# Altium schematic sheet MainLogic.SchDoc
size A4
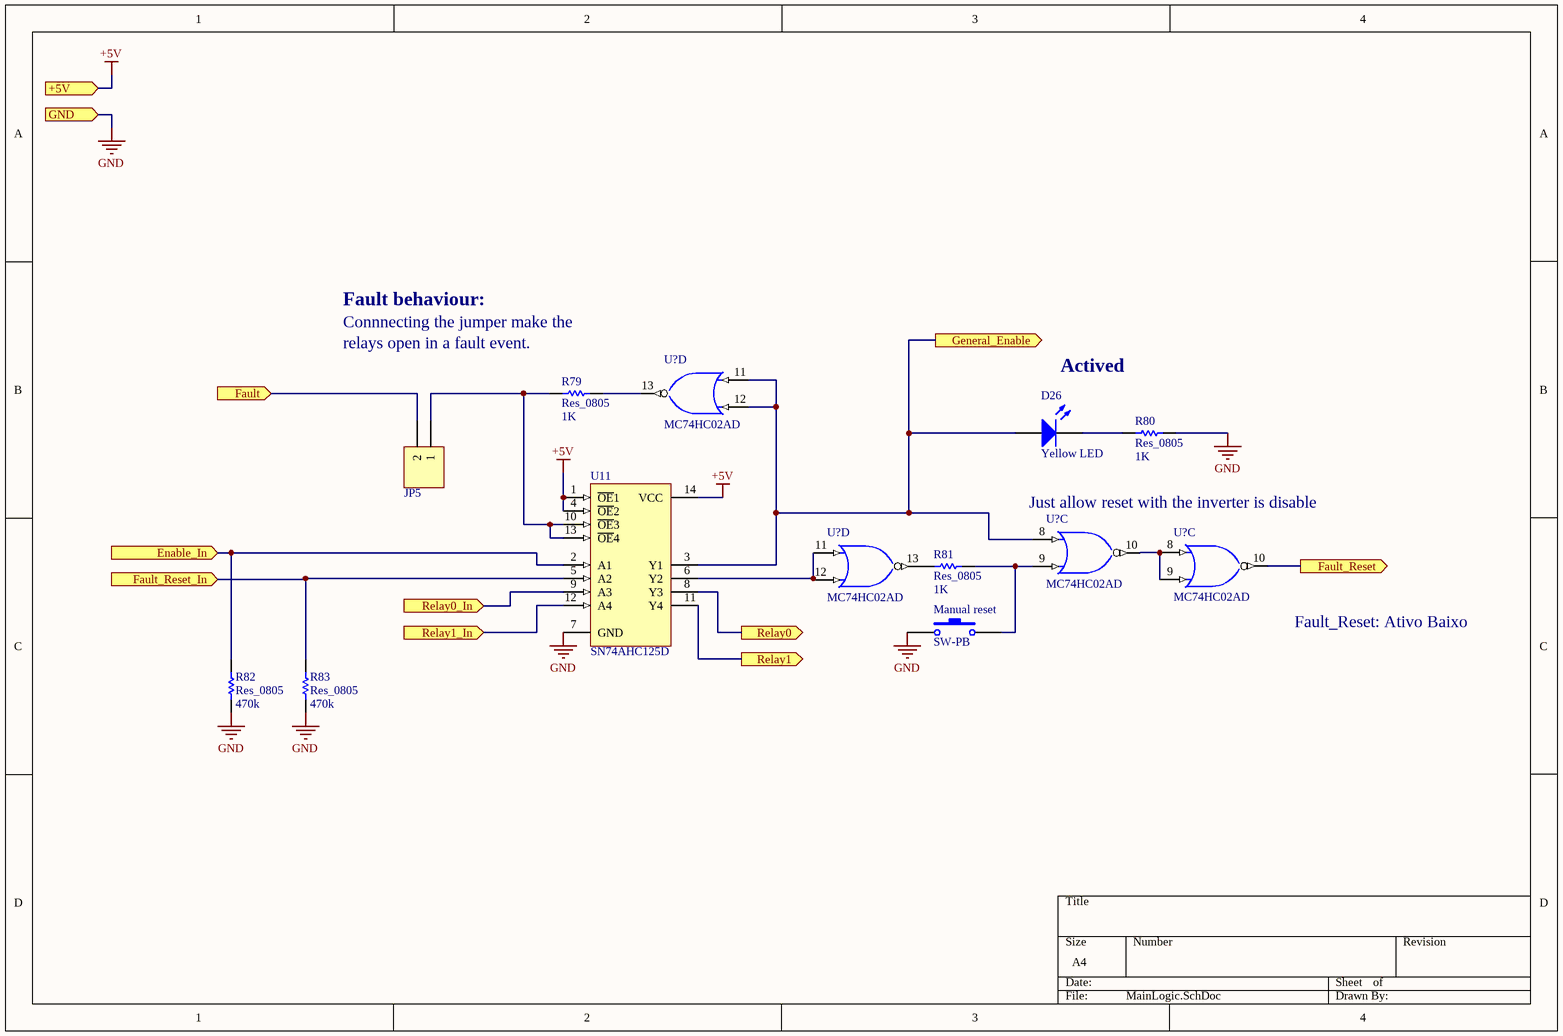
[diagram p0: MainLogic.SchDoc]

## Parts
(Parts that share a designator on the sheet are numbered #1, #2 ... from top to bottom, then left to right.)
D26  Yellow LED  [LED-0]
JP5  (no value)  [HDR1X2]
Manual_reset  SW-PB  [SPST-2]
R79  Res_0805  value 1K  [AXIAL-0.3]
R80  Res_0805  value 1K  [AXIAL-0.3]
R81  Res_0805  value 1K  [AXIAL-0.3]
R82  Res_0805  value 470k  [AXIAL-0.3]
R83  Res_0805  value 470k  [AXIAL-0.3]
U11  SN74AHC125D  [D014_N]
U?#1  MC74HC02AD  [751A-02_N]  (part D of 4)
U?#2  MC74HC02AD  [751A-02_N]  (part C of 4)
U?#3  MC74HC02AD  [751A-02_N]  (part D of 4)
U?#4  MC74HC02AD  [751A-02_N]  (part C of 4)

## Ports
+5V (in), Enable_In (in), Fault (in), Fault_Reset (out), Fault_Reset_In (in), General_Enable (out), GND (in), Relay0 (out), Relay0_In (in), Relay1 (out), Relay1_In (in)

## Nets
+5V: U11.1(~{OE}1) U11.4(~{OE}2) U11.14(VCC) ; port +5V
GND: Manual_reset.2 R80.2 R82.1 R83.1 U11.7(GND) U?#1.7(GND) U?#2.7(GND) U?#3.7(GND) U?#4.7(GND) ; port GND
VDD: U?#1.14(VDD) U?#2.14(VDD) U?#3.14(VDD) U?#4.14(VDD)
Enable_In: R82.2 U11.2(A1) ; port Enable_In
Fault: JP5.2 ; port Fault
Fault_Reset: U?#4.10(Y) ; port Fault_Reset
Fault_Reset_In: R83.2 U11.5(A2) ; port Fault_Reset_In
General_Enable: D26.1(A) U11.3(Y1) U?#1.11(A) U?#1.12(B) U?#2.8(A) ; port General_Enable
Relay0: U11.8(Y3) ; port Relay0
Relay0_In: U11.9(A3) ; port Relay0_In
Relay1: U11.11(Y4) ; port Relay1
Relay1_In: U11.12(A4) ; port Relay1_In
NetD26_2: D26.2(K) R80.1
NetJP5_1: JP5.1 R79.1 U11.10(~{OE}3) U11.13(~{OE}4)
NetManual_reset_1: Manual_reset.1 R81.2 U?#2.9(B)
NetR79_2: R79.2 U?#1.13(Y)
NetR81_1: R81.1 U?#3.13(Y)
NetU11_6: U11.6(Y2) U?#3.11(A) U?#3.12(B)
NetU?#2_10: U?#2.10(Y) U?#4.8(A) U?#4.9(B)

## Notes on the sheet
- Fault behaviour:
- Connnecting the jumper make the
- (near R79) relays open in a fault event.
- Actived
- (near U?#2) Just allow reset with the inverter is disable
- Fault_Reset: Ativo Baixo

## Library data of the parts
D26 = LED0: Typical INFRARED GaAs LED; Published: 8-Jun-2000; LatestRevisionDate: 08-Jul-2005; LatestRevisionNote: Mech Layer 1 removed.; PackageReference: LED-0; Publisher: Altium Limited; PackageDescription: LED; 2 Leads
JP5 = Header 2: Header, 2-Pin; Manufacturer: Generic Components; Class: Connector
Manual_reset = SW-PB: Switch; Published: 24-Mar-1999; LatestRevisionDate: 17-Jul-2002; LatestRevisionNote: Re-released for DXP Platform.; PackageReference: SPST-2; Publisher: Altium Limited; PackageDescription: Switch; 2 Leads
R79-R83 = Res_0805: Resistor; Manufacturer: Generic Components; Class: Passive; Published: 08/06/2000; Publisher: Altium Hobart Technology Centre; SubClass: Resistor
U11 = SN74AHC125D: Quadruple Bus Buffer Gate with 3-State Outputs; Published: 8-Jun-2000; LatestRevisionDate: 13-Apr-2006; LatestRevisionNote: IPC-7351 Footprint Added.; DatasheetVersion: Jul-1998; PackageVersion: Jan-1998; PackageReference: D014; Publisher: Altium Limited; PackageDescription: 14-Pin Small Outline Integrated Circuit 1.27 mm Pitch; Code_IPC: SOIC127P600-14; ComponentLink1Description: Manufacturer Link; ComponentLink1URL: http://www.ti.com/; ComponentLink2Description: Datasheet; ComponentLink2URL: http://www-s.ti.com/sc/ds/sn74ahc125.pdf
U?#1-U?#4 = MC74HC02AD: Quad 2-Input NOR Gate; Published: 17-Jul-2002; LatestRevisionDate: 13-Apr-2006; LatestRevisionNote: IPC-7351 Footprint Added.; DatasheetVersion: 1989; PackageVersion: 1991; PackageReference: 751A-02; Publisher: Altium Limited; PackageDescription: 14-Pin Small Outline Integrated Circuit 1.27 mm Pitch; Code_IPC: SOIC127P600-14; ComponentLink1Description: Manufacturer Link; ComponentLink1URL: http://www.onsemi.com/site/products/parametrics/0,4446,247,00.html; ComponentLink2Description: Ibis Model; ComponentLink2URL: http://www.onsemi.com/pub/Collateral/MC54HC02AJ.IBS